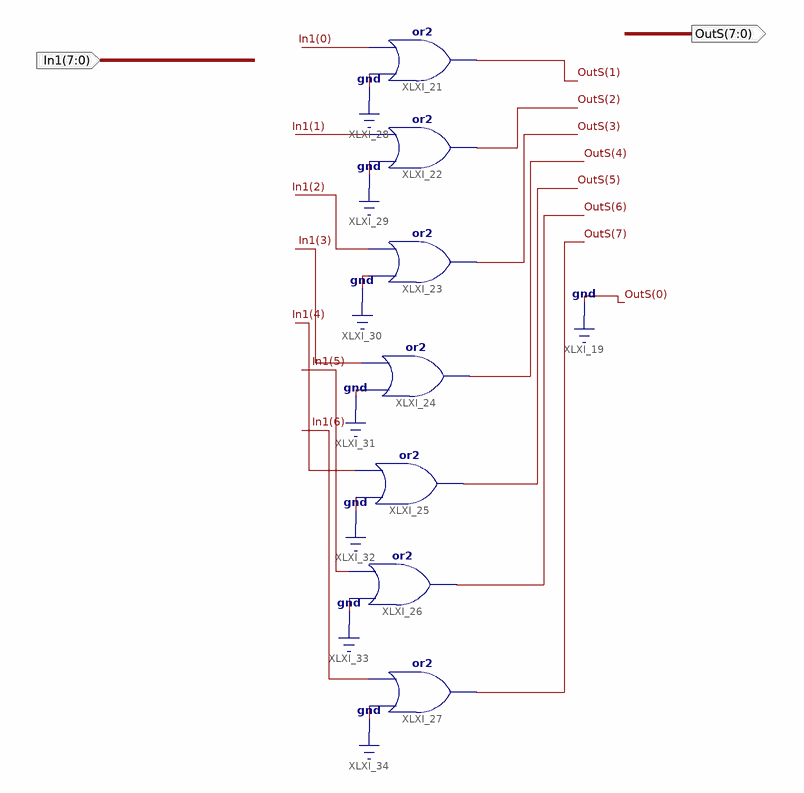
[diagram p0: schematic sheet 1]
// Xilinx ISE schematic shift.sch (spartan6) as structural Verilog: 7 symbols, 2 ports
module shift (
  input  [7:0] In1,
  output [7:0] OutS
);

  or XLXI_21 (OutS[1], 1'b0, In1[0]);
  or XLXI_22 (OutS[2], 1'b0, In1[1]);
  or XLXI_23 (OutS[3], 1'b0, In1[2]);
  or XLXI_24 (OutS[4], 1'b0, In1[3]);
  or XLXI_25 (OutS[5], 1'b0, In1[4]);
  or XLXI_26 (OutS[6], 1'b0, In1[5]);
  or XLXI_27 (OutS[7], 1'b0, In1[6]);

  assign OutS[0] = 1'b0;
endmodule
